# EAGLE schematic dcf77_clock (EAGLE 9.6.2)
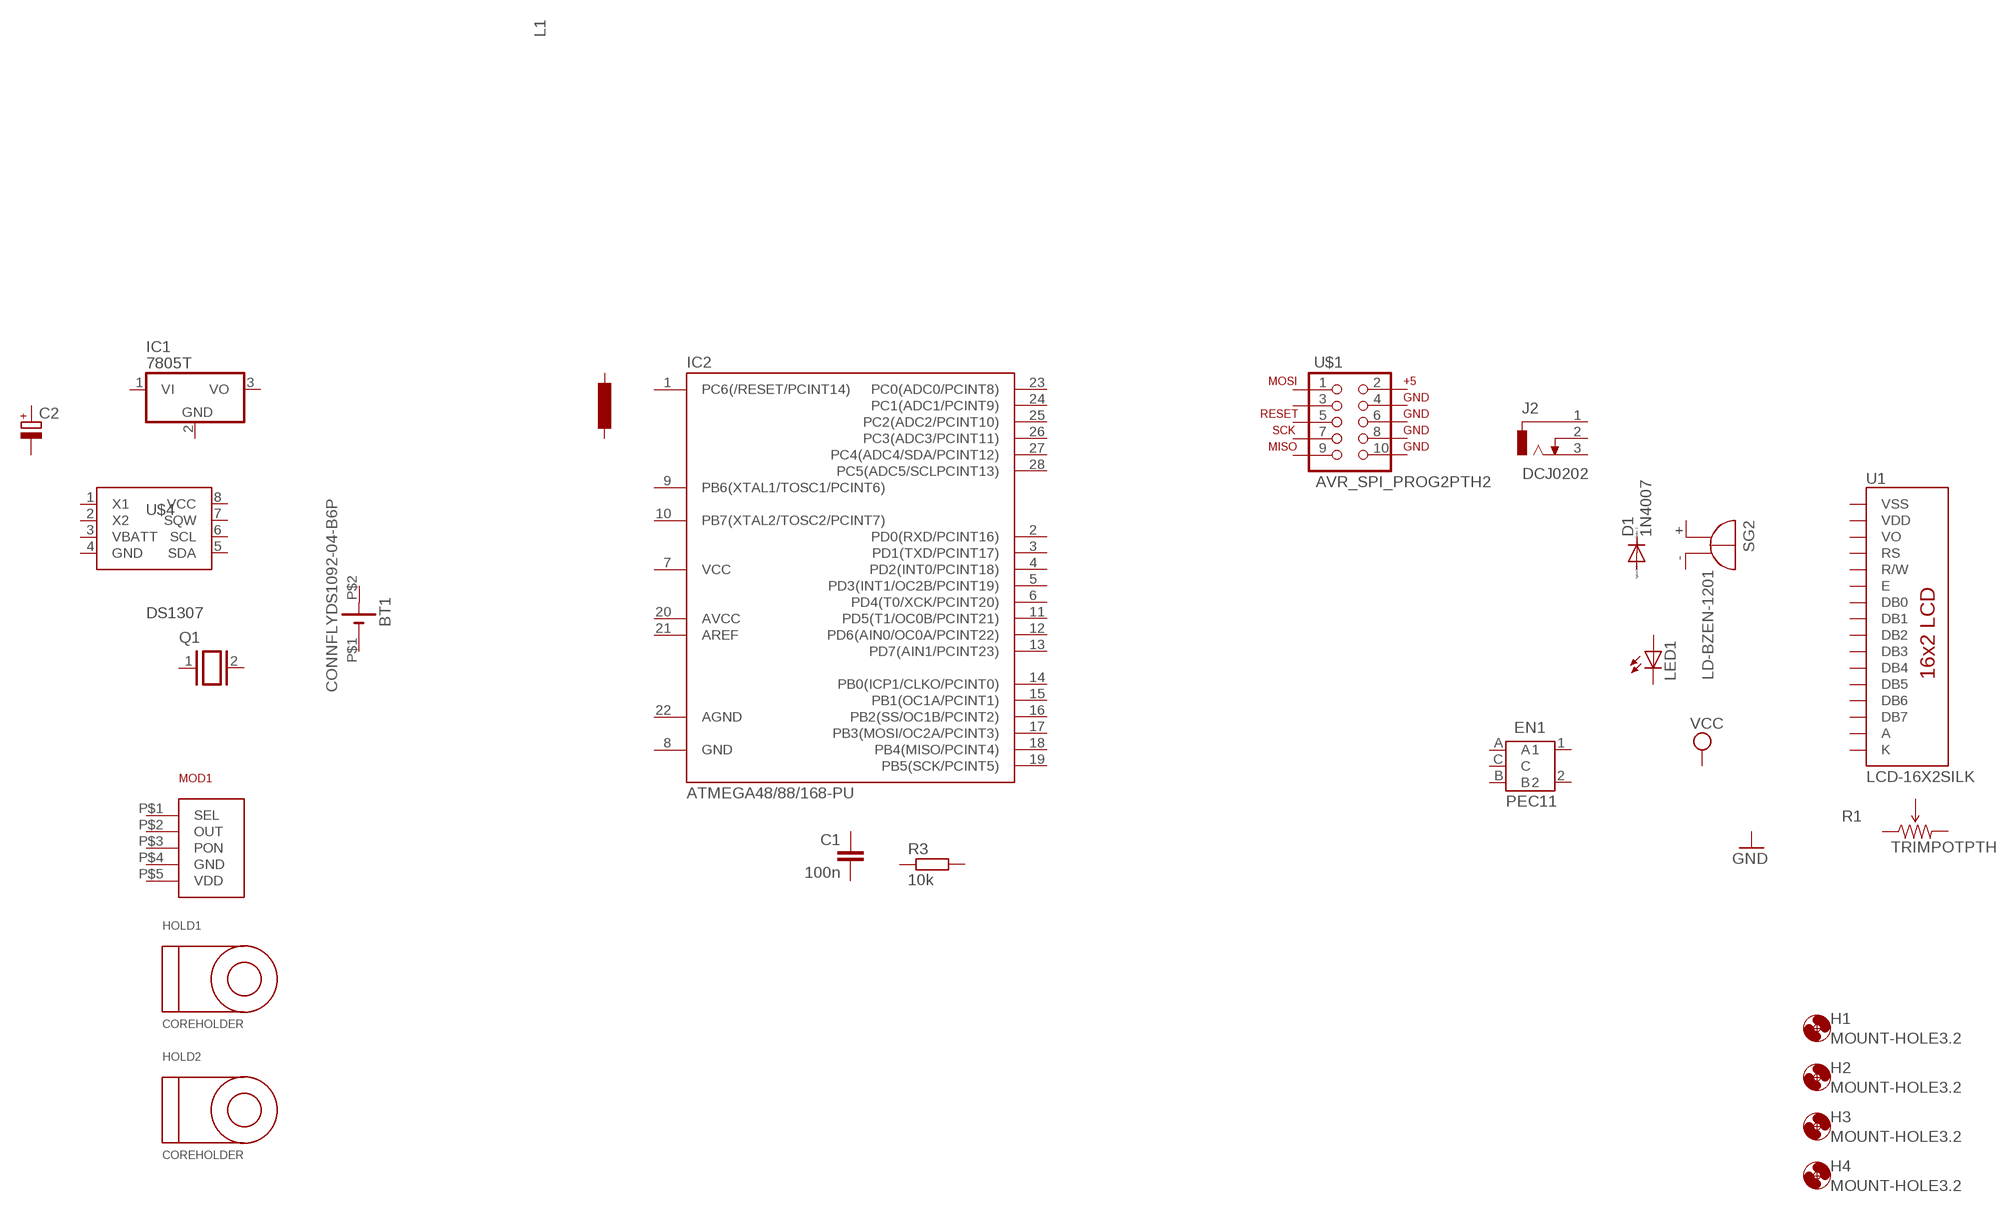
[diagram p0: schematic, sheet 1]

## Parts
BT1  CONNFLYDS1092-04-B6P  [CONNFLYDS1092-04-B6P]
C1  100n  C-EU025-025X050  [C025-025X050]
C2  CPOL-EUE2-5  [E2-5]
D1  1N4007  DIODE-DO41-7.6  [DO41-7.6]
EN1  PEC11  [PEC11_4XXXXK-S]
H1  MOUNT-HOLE3.2  [3,2]
H2  MOUNT-HOLE3.2  [3,2]
H3  MOUNT-HOLE3.2  [3,2]
H4  MOUNT-HOLE3.2  [3,2]
HOLD1  COREHOLDER  [H5P]
HOLD2  COREHOLDER  [H5P]
IC1  7805T  [TO220H]
IC2  ATMEGA48/88/168-PU  [DIL28-3]
J2  DCJ0202  [DCJ0202]
L1  L-EU0204/7  [0204/7]
LED1  LED3MM  [LED3MM]
MOD1  DCF77MODULE  [DCF77MOD]
Q1  XTAL/S  [QS]
R1  TRIMPOTPTH  [TRIM_POT_PTH]
R3  10k  R-EU_0204/7  [0204/7]
SG2  LD-BZEN-1201  F/HMB  [F/HMB]
U1  LCD-16X2SILK  [LCD-16X2]
U$1  AVR_SPI_PROG2PTH2  [2X5-SHROUDED]
U$4  DS1307  [DIL8]
Unconnected: BT1.P$1(-) BT1.P$2(+) C1.1 C1.2 C2.+ C2.- D1.A D1.C EN1.1 EN1.2 EN1.A EN1.B EN1.C IC1.1(VI) IC1.2(GND) IC1.3(VO) IC2.1(PC6(/RESET/PCINT14)) IC2.2(PD0(RXD/PCINT16)) IC2.3(PD1(TXD/PCINT17)) IC2.4(PD2(INT0/PCINT18)) IC2.5(PD3(INT1/OC2B/PCINT19)) IC2.6(PD4(T0/XCK/PCINT20)) IC2.9(PB6(XTAL1/TOSC1/PCINT6)) IC2.10(PB7(XTAL2/TOSC2/PCINT7)) IC2.11(PD5(T1/OC0B/PCINT21)) IC2.12(PD6(AIN0/OC0A/PCINT22)) IC2.13(PD7(AIN1/PCINT23)) IC2.14(PB0(ICP1/CLKO/PCINT0)) IC2.15(PB1(OC1A/PCINT1)) IC2.16(PB2(SS/OC1B/PCINT2)) IC2.17(PB3(MOSI/OC2A/PCINT3)) IC2.18(PB4(MISO/PCINT4)) IC2.19(PB5(SCK/PCINT5)) IC2.20(AVCC) IC2.21(AREF) IC2.23(PC0(ADC0/PCINT8)) IC2.24(PC1(ADC1/PCINT9)) IC2.25(PC2(ADC2/PCINT10)) IC2.26(PC3(ADC3/PCINT11)) IC2.27(PC4(ADC4/SDA/PCINT12)) IC2.28(PC5(ADC5/SCLPCINT13)) J2.1 J2.2 J2.3 L1.1 L1.2 LED1.A LED1.K(C) MOD1.P$1(SEL) MOD1.P$2(OUT) MOD1.P$3(PON) MOD1.P$4(GND) MOD1.P$5(VDD) Q1.1 Q1.2 R1.1(CCW) R1.2(WIPER) R1.3(CW) R3.1 R3.2 SG2.+ SG2.- U1.3(VO) U1.4(RS) U1.5(R/W) U1.6(E) U1.7(DB0) U1.8(DB1) U1.9(DB2) U1.10(DB3) U1.11(DB4) U1.12(DB5) U1.13(DB6) U1.14(DB7) U$1.1 U$1.2 U$1.3 U$1.4 U$1.5 U$1.6 U$1.7 U$1.8 U$1.9 U$1.10 U$4.1(X1) U$4.2(X2) U$4.3(VBATT) U$4.4(GND) U$4.5(SDA) U$4.6(SCL) U$4.7(SQW) U$4.8(VCC)

## Power pins joined to a net without a drawn wire
A: U1.15(A)
AGND: IC2.22(AGND)
GND: IC2.8(GND)
K: U1.16(K)
VCC: IC2.7(VCC)
VDD: U1.2(VDD)
VSS: U1.1(VSS)

## Library data of the parts
BT1 = _mlokc:CONNFLYDS1092-04-B6P: Battery holder for CR2032
C1 = rcl:C-EU: CAPACITOR, European symbol
C2 = rcl:CPOL-EU: POLARIZED CAPACITOR, European symbol; SPICEPREFIX: C
D1 = diode:DIODE-: DIODE
EN1 = bourns:PEC11
H1-H4 = holes:MOUNT-HOLE: MOUNTING HOLE with drill center marker
HOLD1 HOLD2 = dcf77:COREHOLDER
IC1 = linear:78*: Positive VOLTAGE REGULATOR Source: http://cache.national.com/ds/LM/LM78L05.pdf http://www.fairchildsemi.com/ds/LM/LM7805.pdf
IC2 = atmega8:ATMEGA48/88/168-PU
J2 = con-jack:DCJ0202: DC POWER JACK Source: DCJ0202.pdf; OC_FARNELL: unknown; OC_NEWARK: unknown
L1 = rcl:L-EU: INDUCTOR, European symbol; SPICEPREFIX: L
LED1 = SparkFun:LED: LEDs Standard schematic elements and footprints for 5mm, 3mm, 1206, and 0603 sized LEDs. 5mm - Spark Fun Electronics SKU : COM-00529 (and others)
MOD1 = dcf77:DCF77MODULE
Q1 = special:XTAL/S: CRYSTAL
R1 = SparkFun:TRIMPOT
R3 = rcl:R-EU_: RESISTOR, European symbol
SG2 = buzzer:F/HMB: BUZZER Source: Buerklin; OC_FARNELL: unknown; OC_NEWARK: unknown
U1 = SparkFun:LCD-16X2
U$1 = SparkFun:AVR_SPI_PROG2: AVR ICSP Header This is the standard AVR In Circuit Serial Programming header. Minimal, but includes pin one indicator. Works with standard Olimex programmers. Also look for the 6-pin reduced version. Spark Fun Electronics SKU: PRT-00778
U$4 = dcf77:DS1307